# EAGLE design Main_Board (EAGLE 8.4.1)
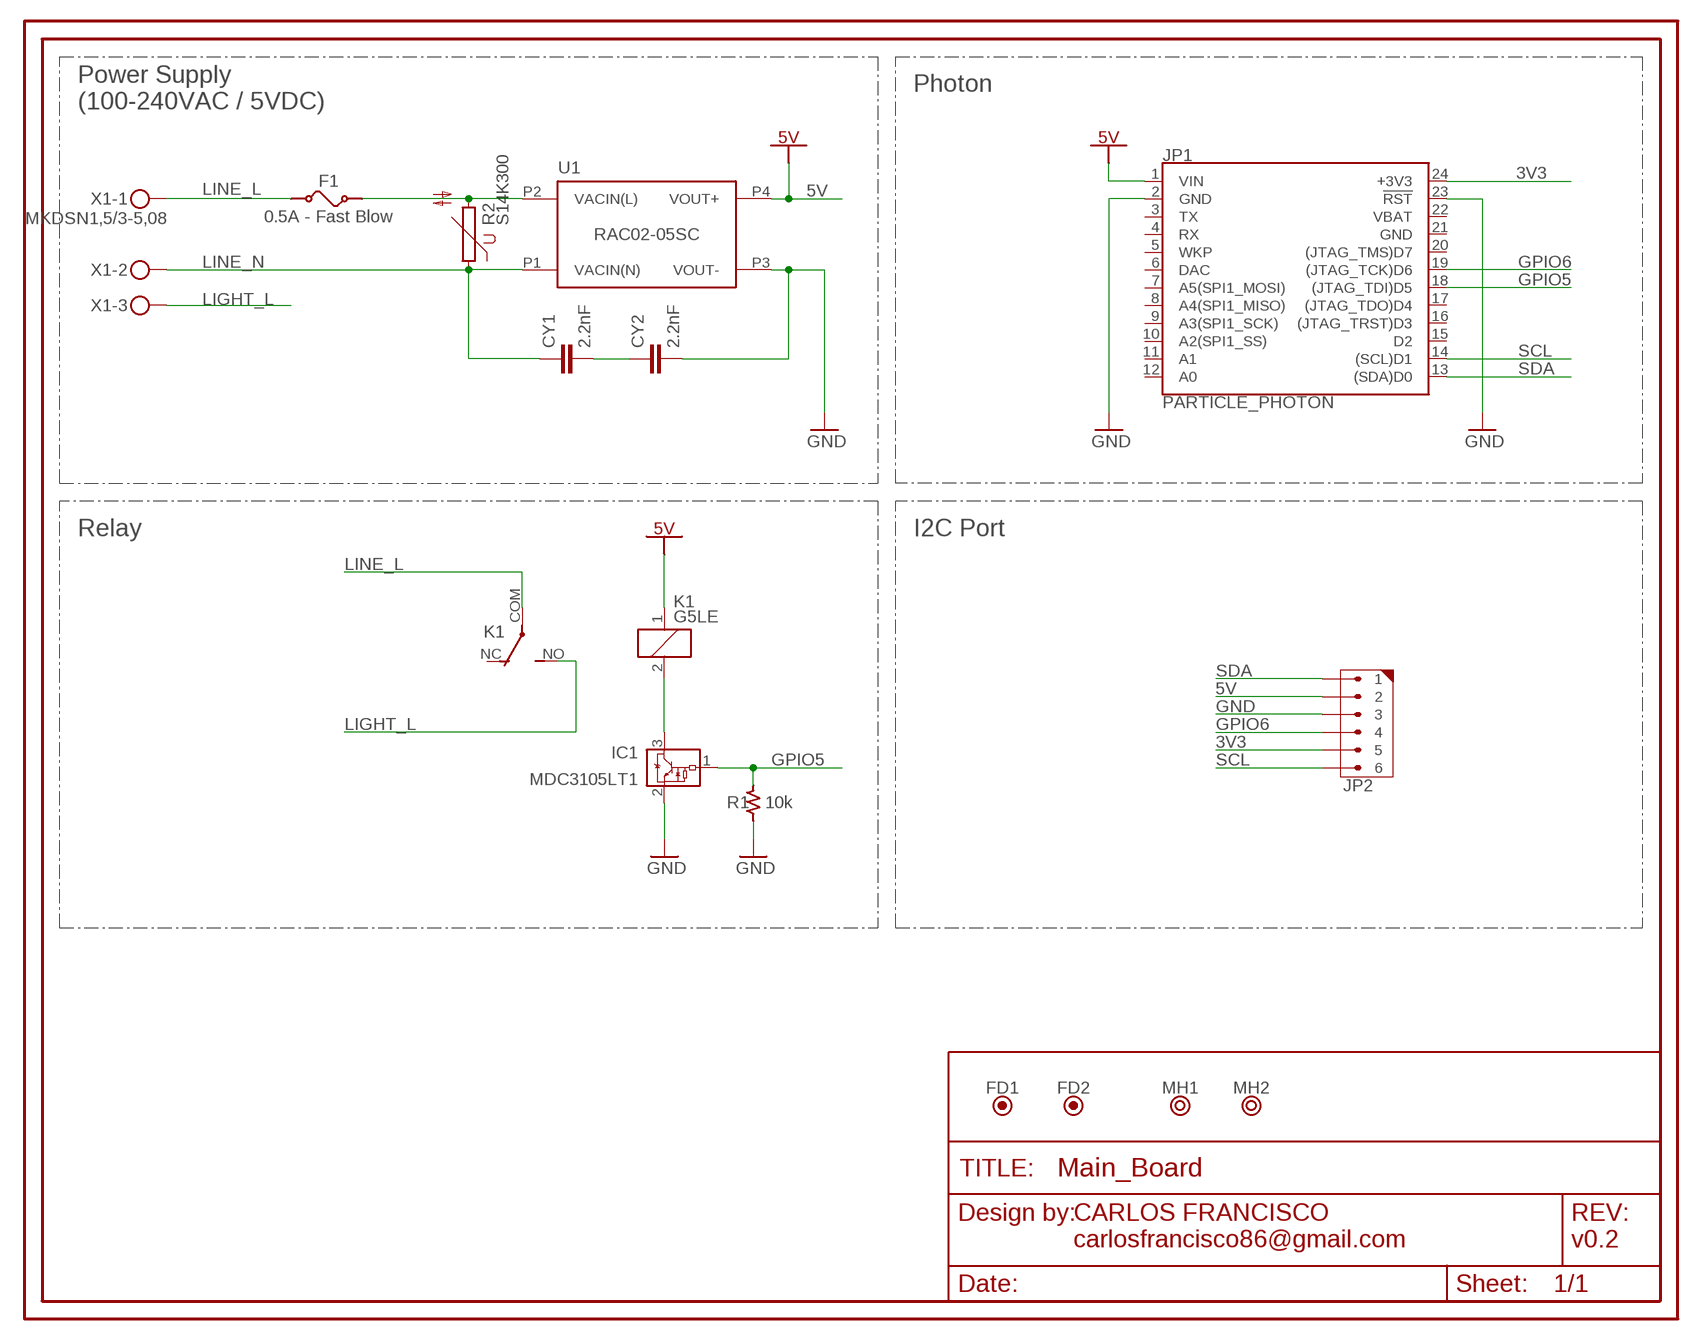
[diagram p0: schematic, sheet 1]

## Parts
CY1  2.2nF  564R30TSD22  [564R30TSD22]
CY2  2.2nF  564R30TSD22  [564R30TSD22]
F1  0.5A - Fast Blow  FUSE0.1A-7A  [FUSE3.6X10MM]
FD1  FIDUCIALBFID  [BOARD_FIDUCIAL]
FD2  FIDUCIALBFID  [BOARD_FIDUCIAL]
IC1  MDC3105LT1  [SOT23]
JP1  PARTICLE_PHOTON  [PARTICLE_PHOTON]
JP2  6X1THT_254MM  [HDRV6W63P254_6X1_1520X280H680]
K1  G5LE  [G5LE]
MH1  MOUNTING_HOLE3.5MM  [MTGP500H350]
MH2  MOUNTING_HOLE3.5MM  [MTGP500H350]
R1  10k  R_THICKFILM2012  [RESC2012X60L35N]
R2  S14K300  [S14K300]
U1  RAC02-05SC  [LOW_PROFILE_POWER_MODULE]
X1  MKDSN1,5/3-5,08  [MKDSN1,5/3-5,08]

## Nets
3V3: JP1.24(+3V3) JP2.5
5V: JP1.1(VIN) JP2.2 K1.1 U1.P4(VOUT+)
CY1CY2: CY1.2 CY2.1
GND: CY2.2 IC1.2(GND) JP1.2(GND) JP1.23(!RST!) JP2.3 R1.1 U1.P3(VOUT-)
GPIO5: IC1.1(VIN) JP1.18((JTAG_TDI)D5) R1.2
GPIO6: JP1.19((JTAG_TCK)D6) JP2.4
LIGHT_L: K1.NO(2:S) X1.3
LINE_L: F1.P$1 K1.COM(2:P) X1.1
LINE_L_F: F1.P$2 R2.2 U1.P2(VACIN(L))
LINE_N: CY1.1 R2.1 U1.P1(VACIN(N)) X1.2
RELAY_IN: IC1.3(VOUT) K1.2
SCL: JP1.14((SCL)D1) JP2.6
SDA: JP1.13((SDA)D0) JP2.1
Unconnected: JP1.3(TX) JP1.4(RX) JP1.5(WKP) JP1.6(DAC) JP1.7(A5(SPI1_MOSI)) JP1.8(A4(SPI1_MISO)) JP1.9(A3(SPI1_SCK)) JP1.10(A2(SPI1_SS)) JP1.11(A1) JP1.12(A0) JP1.15(D2) JP1.16((JTAG_TRST)D3) JP1.17((JTAG_TDO)D4) JP1.20((JTAG_TMS)D7) K1.NC(2:O) MH1.1 MH2.1

## Notes on the sheet
- Photon
- Power Supply
  (100-240VAC / 5VDC)
- Relay | I2C Port
- CARLOS FRANCISCO
  carlosfrancisco86@gmail.com
- v0.2

## Power pins joined to a net without a drawn wire
GND: JP1.21(GND)
VBAT: JP1.22(VBAT)

## Library data of the parts
CY1 CY2 = RodneyPlatt:564R30TSD22: Y Capacitor
F1 = Mtronik-protection:FUSE
FD1 FD2 = Mtronik-Aesthetics:FIDUCIAL: FIDUCIAL Symbol
IC1 = on-semiconductor:MDC3105LT1: Integrated Relay, Inductive Load Driver Sopurce: U6 OnSemi Inductive Load Driver MDC3105-D.PDF; MF: ON SEMICONDUCTOR; MPN: MDC3105LT1; OC_FARNELL: 1126459; OC_NEWARK: 16F6132
JP1 = SparkFun-Boards:PARTICLE_PHOTON: Particle Photon Footprint of the Particle Photon that is used as a basis for many Photon shields. SparkFun Products: Particle Photon <https://www.sparkfun.com/products/13764> SparkFun Photon ProtoShield <https://www.sparkfun.com/products/13598> SparkFun Photon micro OLED Shield <https://www.sparkfun.com/products/13628> SparkFun Photon IMU Shield <https://www.sparkfun.com/products/13629> SparkFun Photon Battery Shield <https://www.sparkfun.com/products/13626>
JP2 = Mtronik-connector:6X1
K1 = RealyChange:G5LE: RELAY 1 x switch, 10 A/120 V AC, 8 A/30 V DC, Omron; OC_FARNELL: unknown; OC_NEWARK: unknown
MH1 MH2 = Mtronik-Aesthetics:MOUNTING_HOLE: MOUNTING HOLE Symbol
R1 = Mtronik-passives:R_THICKFILM: Thick Film Resistor IPC7351C Compliant Package: 0402 (Metric) / 01005 (Inches) Package: 0603 (Metric) / 0201 (Inches) Package: 1005 (Metric) / 0402 (Inches) Package: 1608 (Metric) / 0603 (Inches) Package: 2012 (Metric) / 0805 (Inches) Package: 3216 (Metric) / 1206 (Inches) Package: 3225 (Metric) / 1210 (Inches)
R2 = varistor:S14K300: VARISTOR
U1 = RodneyPlatt:RAC*SC: RECOM POWERLINE AC/DC-Converter (RAC01-SC and RAC02-SC series) The RAC01-SC and RAC02-SC series are ultra-compact universal input AC/DC power modules for PCB mounting. They feature high efficiency, low standby power, high operating temperature, soft start and short-circuit protection as well as a built-in EMC Class B filter. Output voltages range from 3.3VDC to 24VDC. Datasheet <http://www.recom-power.com/pdf/Powerline-AC-DC/RAC01_02-SC.pdf>; INPUT_RANGE: 80 - 277 (VAC); MAX_CAPACITIVE_LOAD: 1200uF; OUTPUT_CURRENT: 400mA; OUTPUT_VOLTAGE: 5v
X1 = con-phoenix-508:MKDSN1,5/3-5,08: MKDSN 1,5/ 3-5,08 Printklemme Nennstrom: 13,5 A Nennspannung: 250 V Rastermaß: 5,08 mm Polzahl: 3 Anschlussart: Schraubanschluss Montage: Löten Anschlussrichtung Leiter/Platine: 0 ° Artikelnummer: 1729131 Source: http://eshop.phoenixcontact.com .. 1729131.pdf

## Board
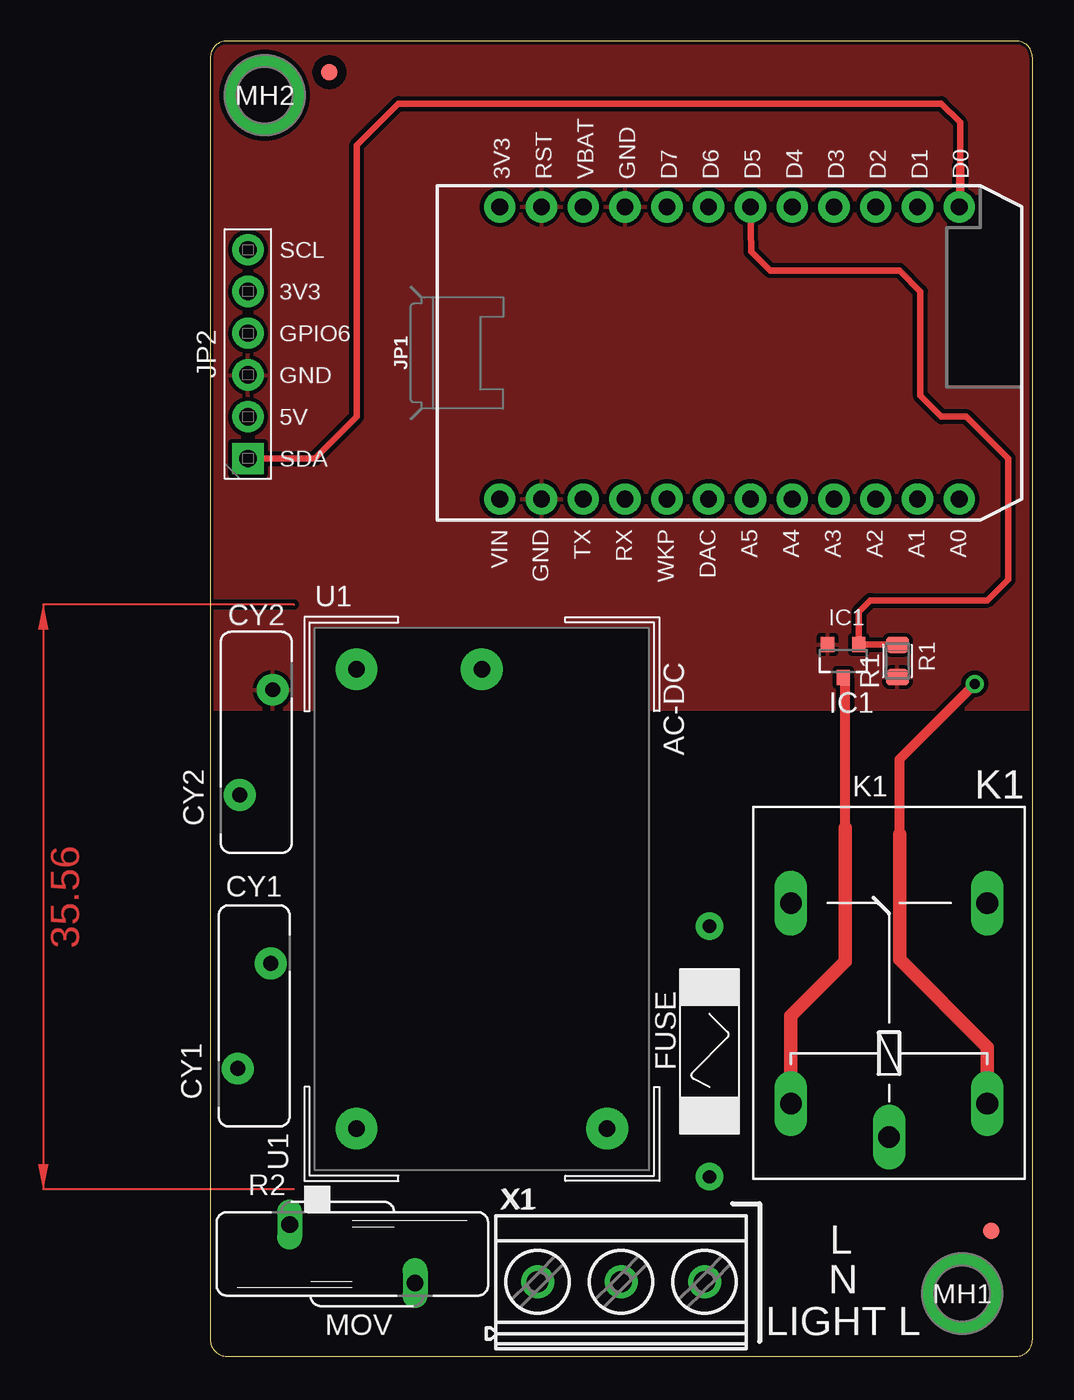
[diagram p1: board, top side]
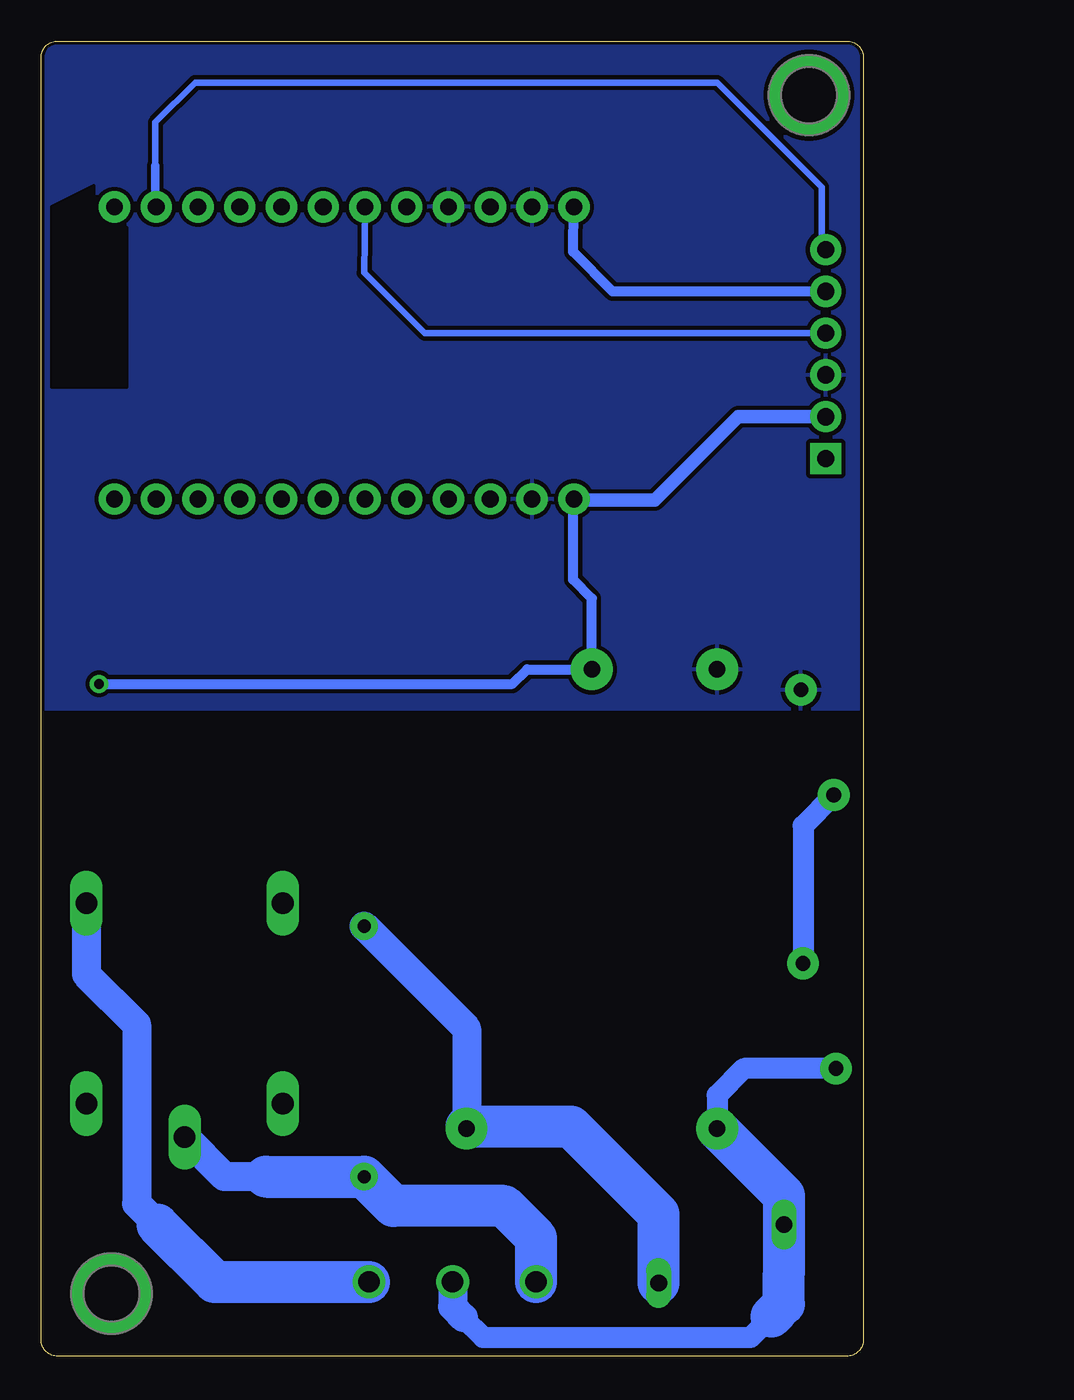
[diagram p2: board, bottom side, seen from below]

Size 50 x 80 mm. Coordinates in mm from the lower left corner, seen from the top.
Outline: 0,79 0,1 arc90 1,0 49,0 arc90 50,1 50,79 arc90 49,80 1,80 arc90 0,79
Copper layers (1*16): Top 0.035mm / dielectric 1.5mm / Bottom 0.035mm
Design rules "SparkFun-2-layer-STANDARD": minimum track width 10mil, minimum drill 20mil, track to track 10mil, track to pad 8mil, pad to pad 8mil, via to via 10mil, smd to smd 8mil, copper to edge 8mil, drill to drill 8mil, minimum pad ring 10mil, minimum via ring 10mil, stop-mask expansion 4mil, vias tented up to drill 25mil, thermal gap 10mil

### Footprints (pad centres in the part's own frame; a part is rotated, then mirrored left to right if it is on the bottom)
564R30TSD22 = drill 0.9 pad 1.93: 1 -1,-3.2; 2 1,3.2
FUSE3.6X10MM = drill 0.8 pad 1.676: P$1 -7.62,0; P$2 7.62,0
BOARD_FIDUCIAL = smd 1 x 1: FID1 0,0
SOT23 = smd 0.8 x 0.9: 1 -0.95,-1; 2 0.95,-1; 3 0,1
PARTICLE_PHOTON = drill 1.016 pad 1.905: 1 -8.89,13.97; 2 -8.89,11.43; 3 -8.89,8.89; 4 -8.89,6.35; 5 -8.89,3.81; 6 -8.89,1.27; 7 -8.89,-1.27; 8 -8.89,-3.81; 9 -8.89,-6.35; 10 -8.89,-8.89; 11 -8.89,-11.43; 12 -8.89,-13.97; 13 8.89,-13.97; 14 8.89,-11.43; 15 8.89,-8.89; 16 8.89,-6.35; 17 8.89,-3.81; 18 8.89,-1.27; 19 8.89,1.27; 20 8.89,3.81; 21 8.89,6.35; 22 8.89,8.89; 23 8.89,11.43; 24 8.89,13.97
HDRV6W63P254_6X1_1520X280H680 = drill 1.05 pad 1.9 square: 1 0,0 | drill 1.05 pad 1.9: 2 2.54,0; 3 5.08,0; 4 7.62,0; 5 10.16,0; 6 12.7,0
G5LE = drill 1.321 long: 1 -7.493,-5.969; 2 -7.493,5.969; COM -9.525,0; NC 4.699,5.969; NO 4.699,-5.969
MTGP500H350 = drill 3.5 pad 5: 1 0,0
RESC2012X60L35N = smd 0.96 x 1.38: 1 -0.98,0; 2 0.98,0
S14K300 = drill 1.016 long: 1 -1.778,-3.81; 2 1.778,3.81
LOW_PROFILE_POWER_MODULE = drill 1 pad 2.54: P1 -12.7,7.62; P2 -12.7,-7.62; P3 15.24,7.62; P4 15.24,0
MKDSN1,5/3-5,08 = drill 1.3 pad 2: 1 -7.641,0.025; 2 -2.561,0.025; 3 2.519,0.025

### Placement (x,y rotation side)
CY1  2.67,20.7 0 top
CY2  2.79,37.34 0 top
F1  30.35,18.54 90 top
FD1  47.5,7.62 0 top
FD2  7.24,78.11 0 top
IC1  38.48,42.29 180 top
JP1  31.57,61.03 90 top
JP2  2.29,54.61 90 top
K1  41.27,22.86 90 top
MH1  45.72,3.81 0 top
MH2  3.3,76.71 0 top
R1  41.78,42.29 90 top
R2  8.64,6.22 270 top
U1  16.51,26.54 90 top
X1  27.54,4.5 0 top

### Tracks (layer width: path | path; a pad name or v marks a point on that pad's centre or on a via)
3V3
  Bottom 0.61: JP2.5 15.24,64.77 17.65,67.18 JP1.24
5V  (via drill 0.6)
  Top 0.61: 41.91,31.75 41.91,36.32 v46.48,40.89
  Top 0.813: K1.1 47.24,18.8 41.91,24.13 41.91,31.75
  Bottom 0.61: v46.48,40.89 21.34,40.89 20.45,41.78 U1.P4 16.51,46.1 17.65,47.24 17.65,52.09 JP1.1
  Bottom 0.813: JP1.1 17.63,52.07 12.7,52.07 7.62,57.15 JP2.2
CY1CY2
  Bottom 1.27: CY2.1 3.67,32.27 CY1.2
GND
  pour Bottom: 50.04,39.37 50.04,79.01 arc90 49.04,80.01 1,80.01 arc90 0,79.01 0,39.37
  pour Top: 0,39.37 0,79.01 arc-90 1,80.01 49.04,80.01 arc-90 50.04,79.01 50.04,39.37
GPIO5
  Top 0.406: JP1.18 32.89,67.18 34.04,66.04 41.91,66.04 43.18,64.77 43.18,58.42 44.45,57.15 45.97,57.15 48.51,54.61 48.51,47.24 47.24,45.97 40.13,45.97 39.43,45.27 IC1.1 41.76,43.29 R1.2
GPIO6
  Bottom 0.406: JP1.19 30.35,65.91 26.67,62.23 JP2.4
LIGHT_L
  Bottom 1.778: K1.NO 47.24,23.24 44.2,20.19 44.2,9.27 42.93,8
  Bottom 2.54: X1.3 39.45,4.53 42.93,8
LINE_L
  Bottom 1.778: K1.COM 38.86,10.92 36.32,10.92
  Bottom 2.54: X1.1 19.9,7.2 21.84,9.14 28.57,9.14 F1.P$1 36.32,10.92
LINE_L_F
  Bottom 1.778: F1.P$2 24.13,19.94 24.13,13.97
  Bottom 2.54: R2.2 12.45,8.64 17.78,13.97 24.13,13.97 U1.P2
LINE_N
  Bottom 1.27: 5.27,2.73 4.83,3.17 | 5.59,2.41 6.86,1.14 23.11,1.14 24.32,2.35 | 4.83,5.08 R2.1 | CY1.1 7.26,17.5 8.89,15.88 U1.P1
  Bottom 1.778: X1.2 24.98,3.01 24.32,2.35
  Bottom 2.54: U1.P1 4.83,9.78 4.83,5.08 4.83,3.17 | 5.27,2.73 5.59,2.41
RELAY_IN
  Top 0.61: 38.61,32.13 38.61,41.16 IC1.3
  Top 0.813: 38.61,32.13 38.61,24 35.31,20.7 K1.2
SCL
  Bottom 0.406: 43.05,72.41 43.05,75.06 40.64,77.47 8.89,77.47 2.54,71.12 2.54,67.56 JP2.6
  Bottom 0.508: 43.05,72.41 43.05,69.97 JP1.14
SDA
  Top 0.406: JP2.1 6.35,54.61 8.89,57.15 8.89,73.66 11.43,76.2 44.45,76.2 45.59,75.06 45.59,72.41
  Top 0.508: 45.59,72.41 45.59,69.97 JP1.13
(copper drawn outside any net)
  shapes: Top area x1

### Text on the board
tPlace: 3V3 | RST | VBAT | GND | D7 | D6 | D5 | D4 | D3 | D2 | D1 | D0 | SCL | 3V3 | GPIO6 | GND | 5V | SDA | VIN | GND | TX | RX | WKP | DAC | A5 | A4 | A3 | A2 | A1 | A0 | U1 | CY2 | IC1 | R1 | AC-DC | K1 | CY1 | FUSE | X1 | L | N | MOV | LIGHT L